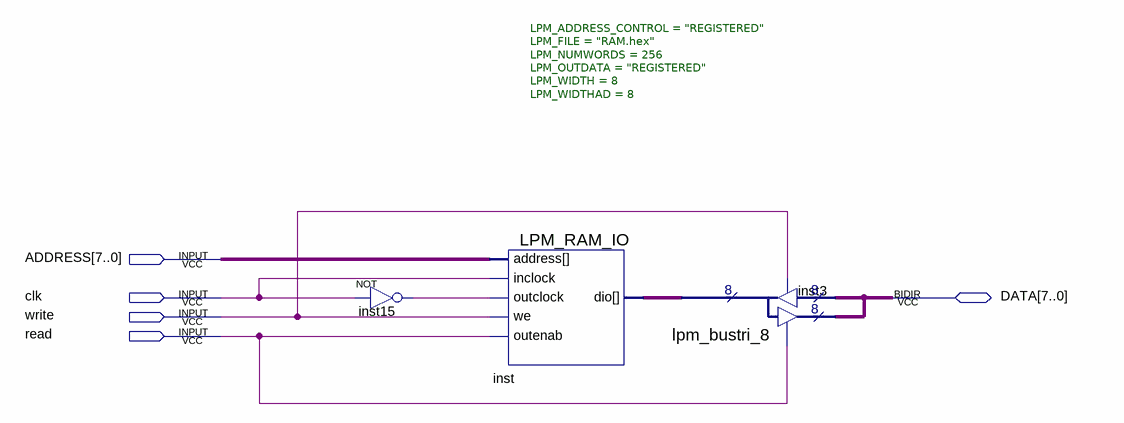
[diagram p0: schematic sheet]
// Quartus schematic RAM.bdf as structural Verilog: 3 symbols, 5 pins
module RAM (
  input  [7:0] ADDRESS,
  input  clk,
  input  write,
  input  read,
  inout  [7:0] DATA
);

  wire inst15_out;
  wire [7:0] inst_dio;

  not inst15 (inst15_out, clk);
  LPM_RAM_IO #(.LPM_ADDRESS_CONTROL("REGISTERED"), .LPM_FILE("RAM.hex"), .LPM_NUMWORDS(256), .LPM_OUTDATA("REGISTERED"), .LPM_WIDTH(8), .LPM_WIDTHAD(8)) inst (
    .address(ADDRESS), .outclock(inst15_out), .inclock(clk), .we(write), .outenab(read), .dio(inst_dio));
  lpm_bustri_8 inst3 (.enabledt(write), .data(DATA), .enabletr(read), .result(DATA), .tridata(inst_dio));
endmodule
